# Altium schematic sheet PWM_ABZ_MOTOR2.SchDoc
size A4; SheetNumber: 8; SheetTotal: 8
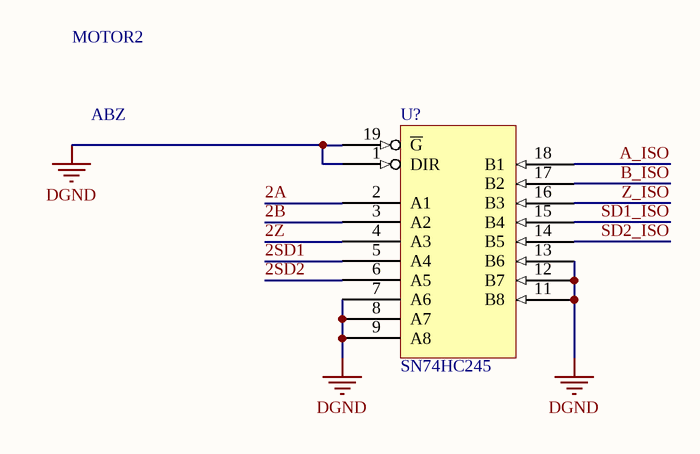
[diagram p0: PWM_ABZ_MOTOR2.SchDoc]

## Parts
U?  SN74HC245  [TSSOP-20]

## Nets
DGND: U?.1(DIR) U?.7(A6) U?.8(A7) U?.9(A8) U?.11(B8) U?.12(B7) U?.13(B6) U?.19(~{G})
GND: U?.10(DGND)
VCC: U?.20(3V3DVCC)
2A: U?.2(A1)
2B: U?.3(A2)
2SD1: U?.5(A4)
2SD2: U?.6(A5)
2Z: U?.4(A3)
A_ISO: U?.18(B1)
B_ISO: U?.17(B2)
SD1_ISO: U?.15(B4)
SD2_ISO: U?.14(B5)
Z_ISO: U?.16(B3)

## Notes on the sheet
- MOTOR2
- ABZ

## Library data of the parts
U? = SN74HC245: QUAD BUS TRANSCEIVER 3SO